# EasyEDA Pro project NE555_BlinkPCB.eprj

# Schematic Schematic1
Board Name: Board1; Create Date: 2025-10-31; Page Name: P1; Project Name: NE555_BlinkPCB; Schematic Name: Schematic1; Update Date: 2025-10-31; Company: EasyEDA.com; Page Size: A4; Version: V1.0
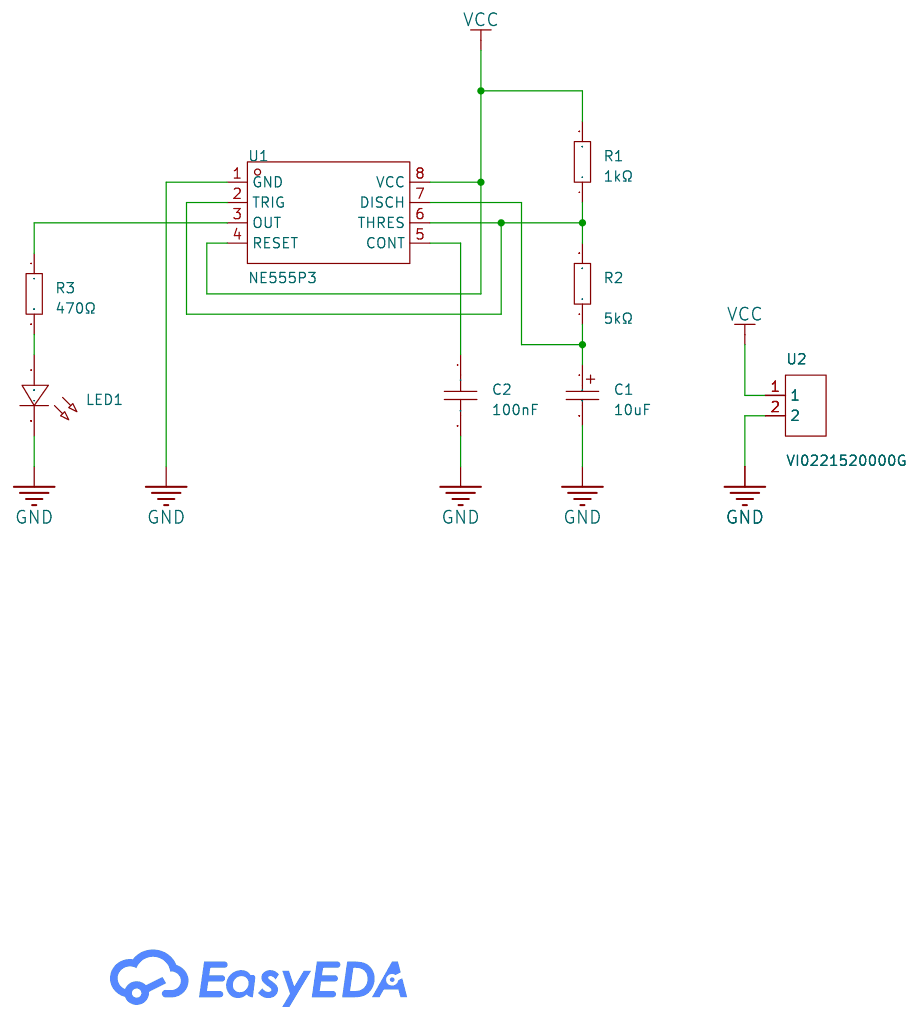
[diagram p0: schematic sheet]

## Parts
C1  10uF  [CAP-TH_BD5.0-P2.00-D0.8-FD]
C2  100nF  [CAP-TH_L5.8-W2.8]
LED1  -  [LED-TH_BD5.8-P2.54-FD]
R1  1kΩ  [RES-TH_BD1.8-L3.2-P7.20-D0.4]
R2  5kΩ  [RES-TH_BD1.8-L3.2-P7.20-D0.4]
R3  470Ω  [RES-TH_BD1.8-L3.2-P7.20-D0.4]
U1  NE555P3  [PDIP-8_L9.6-W6.4-P2.54-LS7.9-BL-1]
U2  VI0221520000G  [CONN-TH_2P-P5.08_VI0221520000G]

## Library data of the parts
C1 = KM106M016D11RR0VH2FP0: Capacitance:10uF Tolerance:±20% Tolerance:±20% Voltage Rating:16V Ripple Current:35mA@120Hz Equivalent Series Resistance(ESR):- Pin Spacing:2mm Diameter:5mm Height - Seated (Max):11mm Lifetime:1000hrs@105℃; LCSC Part Name: 10uF ±20% 16V; Supplier Part: C43799; Manufacturer: Chengx(承兴); Supplier Footprint: 插件,D5xL11mm; JLCPCB Part Class: Extended Part; Datasheet: https://item.szlcsc.com/datasheet/KM106M016D11RR0VH2FP0/44801.html; Supplier: LCSC; Tolerance: ±20%; Voltage Rating: 16V; Ripple Current: 35mA@120Hz; Pin Spacing: 2mm; Diameter: 5mm; Height - Seated (Max): 11mm; Lifetime: 1000hrs@105℃
C2 = CC1H104MC1FD3F6C10SA: Capacitance:100nF Tolerance:±20% Tolerance:±20% Voltage Rating:50V Pin Spacing:5.08mm Temperature Coefficient:Y5V Diameter:5.8mm Body Thickness:2.4mm; LCSC Part Name: 100nF ±20% 50V; Supplier Part: C5375966; Manufacturer: Dersonic(德尔创); Supplier Footprint: 插件,P=5.08mm; JLCPCB Part Class: Extended Part; Datasheet: https://item.szlcsc.com/datasheet/CC1H104MC1FD3F6C10SA/6236644.html; Supplier: LCSC; Tolerance: ±20%; Voltage Rating: 50V; Pin Spacing: 5.08mm; Temperature Coefficient: Y5V; Diameter: 5.8mm; Body Thickness: 2.4mm
LED1 = LED_TH-R_5mm: Supplier Footprint: Through
R1-R3 = Res_AXIAL-1/8W: Supplier Footprint: Through
U1 = NE555P3: Supplier Part: C3301080; Manufacturer: TI(德州仪器); JLCPCB Part Class: Extended Part; Datasheet: https://atta.szlcsc.com/upload/public/pdf/source/20230921/CD565B02C6187C0B14E53274C677C859.pdf; Supplier: LCSC
U2 = VI0221520000G: Pitch:5.08mm Color:Green Mounting Type:Through Hole Number of Pins:2P Number of Rows:1 Number of PINs Per Row:2 Current Rating:16A Voltage Rating (Max):300V; LCSC Part Name: 5.08mm 排数:1 每排P数:2 直插; Supplier Part: C5995628; Manufacturer: Amphenol; Supplier Footprint: 插件,P=5.08mm; JLCPCB Part Class: Extended Part; Datasheet: https://item.szlcsc.com/datasheet/VI0221520000G/6933893.html; Supplier: LCSC; Pitch: 5.08mm; Color: Green; Mounting Type: Through Hole; Number of Pins: 2P; Number of Rows: 1; Number of PINs Per Row: 2; Current Rating: 16A; Voltage Rating (Max): 300V

## Nets
GND: C1.2 C2.2 LED1.2(A) U1.1(GND) U2.2
VCC: R1.2 U1.4(RESET) U1.8(VCC) U2.1
$1N535: R1.1 R2.2 U1.2(TRIG) U1.6(THRES)
$1N588: C1.1 R2.1 U1.7(DISCH)
$1N693: R3.1 U1.3(OUT)
$1N698: LED1.1(C) R3.2
$1N767: C2.1 U1.5(CONT)

# Board PCB1
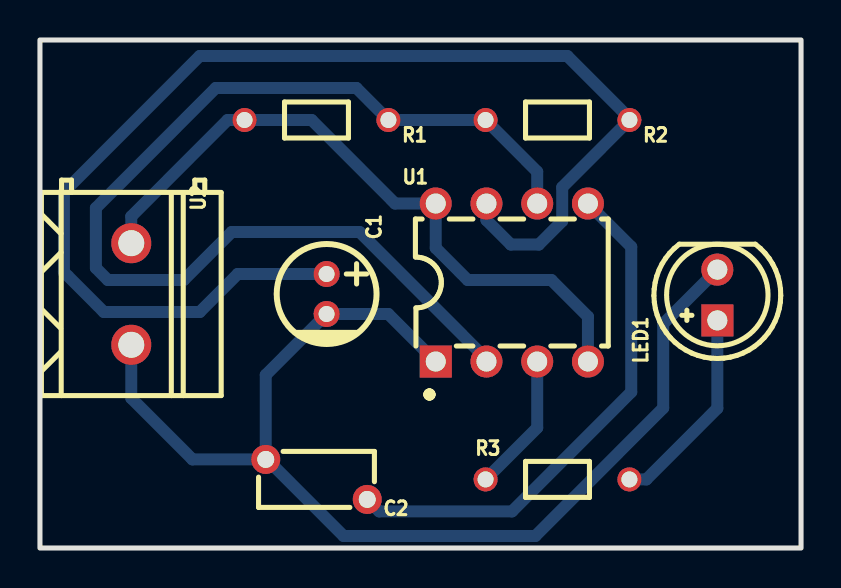
[diagram p1: board, top side]
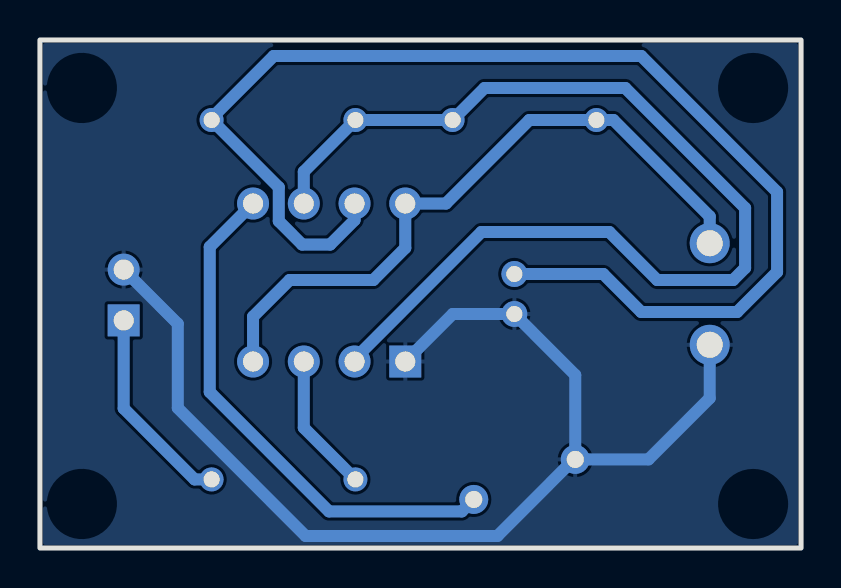
[diagram p2: board, bottom side, seen from below]

Outline 38.1 x 25.4 mm; copper layers: Top Layer, Bottom Layer. Coordinates in mm from the lower left corner of the outline.
Outline path: rectangle 0,25.4 38.1,0
Stack: Top Layer 0.035mm / Dielectric1 1.51mm FR4 er 4.5 / Bottom Layer 0.035mm

## Design rules (mm)
template: JLCPCB Capability(Two Layers Board)
spacing copperThickness1oz (default): track to track 0.102, other pairs 0.152 to 0.3
spacing copperThickness2oz: track to track 0.203, other pairs 0.152 to 0.3
track width copperThickness1oz (default): min 0.127, default 0.254, max 2.54
track width copperThickness2oz: min 0.203, default 0.254, max 2.54
differential pair differentialPair (default): width min 0.127, default 0.254, max 2.54; gap min 0.152, default 0.152
via viaSize (default): diameter min 0.5, default 0.61, max 10; hole min 0.3, default 0.305, max 6.3

## Placement (name value [footprint] x y rotation side)
C1  10uF  [CAP-TH_BD5.0-P2.00-D0.8-FD]  14.35 12.7 270 top
C2  100nF  [CAP-TH_L5.8-W2.8]  13.84 3.43 180 top
LED1  -  [LED-TH_BD5.8-P2.54-FD]  33.91 12.65 90 top
R1  1kΩ  [RES-TH_BD1.8-L3.2-P7.20-D0.4]  13.84 21.4 180 top
R2  5kΩ  [RES-TH_BD1.8-L3.2-P7.20-D0.4]  25.91 21.4 180 top
R3  470Ω  [RES-TH_BD1.8-L3.2-P7.20-D0.4]  25.91 3.43 0 top
U1  NE555P3  [PDIP-8_L9.6-W6.4-P2.54-LS7.9-BL-1]  23.62 13.27 0 top
U2  VI0221520000G  [CONN-TH_2P-P5.08_VI0221520000G]  4.57 12.7 270 top

## Footprints (pads in the part's own frame, mm; a bottom-side part is the same pattern mirrored in y, then rotated)
CAP-TH_BD5.0-P2.00-D0.8-FD
  round 1.3 hole 0.8: 1(-1,0) 2(1,0)
CAP-TH_L5.8-W2.8
  round 1.45 hole 0.85: 1(-2.54,1) 2(2.54,-1)
CONN-TH_2P-P5.08_VI0221520000G
  round 2 hole 1.3: 1(-2.54,0) 2(2.54,0)
LED-TH_BD5.8-P2.54-FD
  rect 1.6x1.6 hole 1: 1(-1.27,0)
  round 1.6 hole 1: 2(1.27,0)
PDIP-8_L9.6-W6.4-P2.54-LS7.9-BL-1
  rect 1.6x1.6 hole 1: 1(-3.81,-3.95)
  round 1.6 hole 1: 2(-1.27,-3.95) 3(1.27,-3.95) 4(3.81,-3.95) 5(3.81,3.95) 6(1.27,3.95) 7(-1.27,3.95) 8(-3.81,3.95)
RES-TH_BD1.8-L3.2-P7.20-D0.4
  round 1.2 hole 0.8: 1(-3.6,0) 2(3.6,0)

## Nets
As in the schematic.

## Routing (per net, layer and track width the routed paths; a pad name or vN(x,y) marks a point on that pad's centre or on a via; arc(x,y) is an arc through that point)
GND: length 57.8
  Bottom Layer w0.6: U2.2 4.57,7.49 7.64,4.43 C2.2 ; LED1.2 31.2,11.21 31.2,7 24.8,0.6 15.2,0.6 11.37,4.43 C2.2 ; C2.2 11.3,8.65 C1.2 17.44,11.7 U1.1
VCC: length 33.8
  Bottom Layer w0.6: U2.1 4.57,16.58 9.39,21.4 10.24,21.4 ; R1.2 13.6,21.4 17.78,17.22 U1.8 19.81,15 21.41,13.4 25.6,13.4 27.43,11.57 U1.4
$1N535: length 54.5
  Bottom Layer w0.6: U1.6 24.89,18.82 R2.2 17.44,21.4 15.84,23 8.8,23 2.8,17 2.8,14 3.4,13.4 7.2,13.4 9.6,15.8 16,15.8 22.35,9.45 U1.2
$1N588: length 63.3
  Bottom Layer w0.6: C1.1 9.9,13.7 8,11.8 3.2,11.8 1.2,13.8 1.2,17.8 8,24.6 26.4,24.6 29.51,21.49 R2.1 26.14,18.04 26.14,16.34 24.97,15.17 23.57,15.17 22.35,16.39 U1.7
$1N693: length 7
  Bottom Layer w0.6: R3.1 24.89,6.01 U1.3
$1N698: length 10.3
  Bottom Layer w0.6: LED1.1 33.91,6.98 30.36,3.43 R3.2
$1N767: length 26.3
  Bottom Layer w0.6: U1.5 29.6,15.06 29.6,7.8 23.63,1.83 16.98,1.83 16.38,2.43

## Copper pours and planes (outline as drawn; the poured copper is in the pictures)
GND on Bottom Layer: 0,25.4 38.1,25.4 38.1,0 0,0
